# EAGLE design Mega_Shield-v13-VertPlace7 (EAGLE 7.5.0)
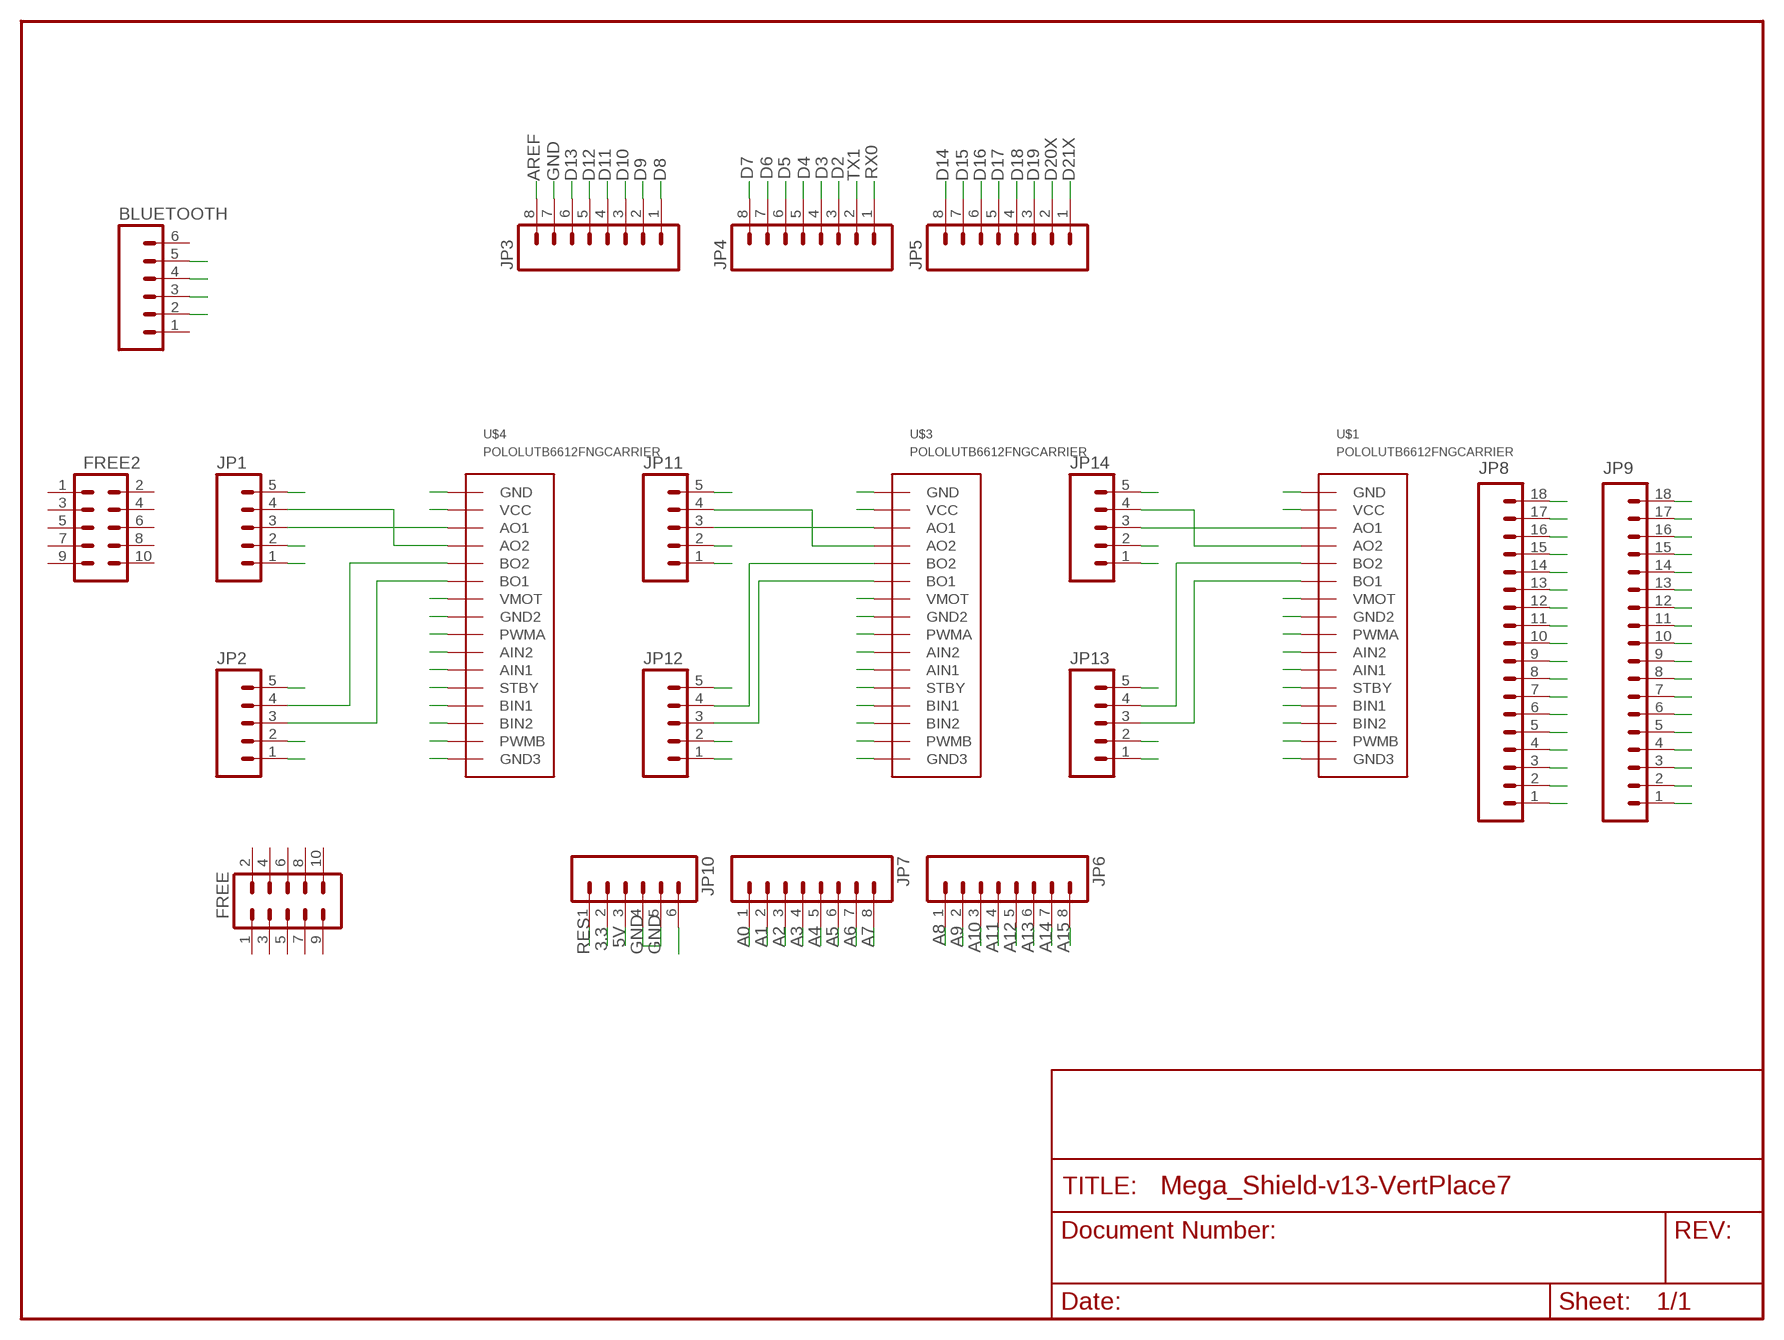
[diagram p0: schematic, sheet 1]

## Parts
BLUETOOTH  M06FEMALE_LOCK  [1X06_FEMALE_LOCK.010]
FREE  M05X2NO_SILK  [2X5_NOSILK]
FREE2  M05X2NO_SILK  [2X5_NOSILK]
JP1  M05LOCK  [1X05_LOCK]
JP2  M05LOCK  [1X05_LOCK]
JP3  M08LOCK  [1X08_LOCK]
JP4  M08LOCK  [1X08_LOCK]
JP5  M08LOCK  [1X08_LOCK]
JP6  M08LOCK  [1X08_LOCK]
JP7  M08LOCK  [1X08_LOCK]
JP8  M18_  [1X18]
JP9  M18_  [1X18]
JP10  M06LOCK  [1X06_LOCK]
JP11  M05LOCK  [1X05_LOCK]
JP12  M05LOCK  [1X05_LOCK]
JP13  M05LOCK  [1X05_LOCK]
JP14  M05LOCK  [1X05_LOCK]
U$1  POLOLUTB6612FNGCARRIER  [THROUGHHOLECARRIER]
U$3  POLOLUTB6612FNGCARRIER  [THROUGHHOLECARRIER]
U$4  POLOLUTB6612FNGCARRIER  [THROUGHHOLECARRIER]

## Nets
3.3: JP10.2
5V: BLUETOOTH.5 JP1.5 JP2.5 JP8.18 JP9.18 JP10.3 JP11.5 JP12.5 JP13.5 JP14.5 U$1.2(VCC) U$1.12(STBY) U$3.2(VCC) U$3.12(STBY) U$4.2(VCC) U$4.12(STBY)
A0: JP7.1 JP14.2
A1: JP7.2 JP13.2
A2: JP7.3 JP11.2
A3: JP7.4 JP12.2
A4: JP1.2 JP7.5
A5: JP2.2 JP7.6
A6: JP7.7
A7: JP7.8
A8: JP6.1
A9: JP6.2
A10: JP6.3
A11: JP6.4
A12: JP6.5
A13: JP6.6
A14: JP6.7
A15: JP6.8
AREF: JP3.8
D2: JP4.3 U$1.9(PWMA)
D3: JP4.4 U$1.15(PWMB)
D4: JP4.5 U$3.9(PWMA)
D5: JP4.6 U$3.15(PWMB)
D6: JP4.7 U$4.9(PWMA)
D7: JP4.8 U$4.15(PWMB)
D8: JP3.1
D9: JP3.2
D10: JP3.3
D11: JP3.4
D12: BLUETOOTH.2 JP3.5
D13: BLUETOOTH.3 JP3.6
D14: JP5.8
D15: JP5.7
D16: JP5.6
D17: JP5.5
D18: JP5.4
D19: JP5.3
D20X: JP5.2
D21X: JP5.1
D22: JP8.17
D23: JP9.17
D24: JP8.16
D25: JP9.16
D26: JP8.15
D27: JP9.15
D28: JP8.14
D29: JP9.14
D30: JP8.13
D31: JP9.13
D32: JP8.12
D33: JP9.12
D34: JP8.11
D35: JP9.11
D36: JP8.10
D37: JP9.10
D38: JP8.9
D40: JP8.8
D41: JP9.8
D42: JP8.7 U$4.14(BIN2)
D43: JP9.7 U$4.13(BIN1)
D44: JP8.6 U$4.10(AIN2)
D45: JP9.6 U$4.11(AIN1)
D46: JP8.5 U$3.14(BIN2)
D47: JP9.5 U$3.13(BIN1)
D48: JP8.4 U$3.10(AIN2)
D49: JP9.4 U$3.11(AIN1)
D50: JP8.3 U$1.14(BIN2)
D51: JP9.3 U$1.13(BIN1)
D52: JP8.2 U$1.10(AIN2)
D53: JP9.2 U$1.11(AIN1)
GND: BLUETOOTH.4 JP1.1 JP2.1 JP3.7 JP8.1 JP9.1 JP10.4 JP10.5 JP11.1 JP12.1 JP13.1 JP14.1 U$1.1(GND) U$1.8(GND2) U$1.16(GND3) U$3.1(GND) U$3.8(GND2) U$3.16(GND3) U$4.1(GND) U$4.8(GND2) U$4.16(GND3)
N$1: JP14.3 U$1.3(AO1)
N$3: JP9.9
N$5: JP14.4 U$1.4(AO2)
N$6: JP13.3 U$1.6(BO1)
N$7: JP13.4 U$1.5(BO2)
N$8: JP11.3 U$3.3(AO1)
N$11: JP12.3 U$3.6(BO1)
N$12: JP12.4 U$3.5(BO2)
N$13: JP11.4 U$3.4(AO2)
N$14: JP1.3 U$4.3(AO1)
N$15: JP1.4 U$4.4(AO2)
N$16: JP2.3 U$4.6(BO1)
N$17: JP2.4 U$4.5(BO2)
RES: JP10.1
RX0: JP4.1
TX1: JP4.2
VIN [PWR]: JP10.6 U$1.7(VMOT) U$3.7(VMOT) U$4.7(VMOT)
Unconnected: BLUETOOTH.1 BLUETOOTH.6 FREE2.1 FREE2.2 FREE2.3 FREE2.4 FREE2.5 FREE2.6 FREE2.7 FREE2.8 FREE2.9 FREE2.10 FREE.1 FREE.2 FREE.3 FREE.4 FREE.5 FREE.6 FREE.7 FREE.8 FREE.9 FREE.10

## Library data of the parts
BLUETOOTH = SparkFun-Connectors:M06: Header 6 Standard 6-pin 0.1" header. Use with straight break away headers (SKU : PRT-00116), right angle break away headers (PRT-00553), swiss pins (PRT-00743), machine pins (PRT-00117), and female headers (PRT-00115). Molex polarized connector foot print use with SKU : PRT-08094 with associated ...
FREE FREE2 = SparkFun-Connectors:M05X2: Header 5x2 Standard 10-pin dual row 0.1" header. Commonly used with AVR-ISP. Use with Spark Fun Electronics SKU: PRT-00778
JP1 JP2 JP11-JP14 = SparkFun-Connectors:M05: Header 5 Standard 5-pin 0.1" header. Use with straight break away headers (SKU : PRT-00116), right angle break away headers (PRT-00553), swiss pins (PRT-00743), machine pins (PRT-00117), and female headers (PRT-00115). Molex polarized connector foot print use with SKU : PRT-08230 with associated crimp pins and housings.
JP3-JP7 = SparkFun:M08: Header 8 Standard 8-pin 0.1" header. Use with straight break away headers (SKU : PRT-00116), right angle break away headers (PRT-00553), swiss pins (PRT-00743), machine pins (PRT-00117), and female headers (PRT-00115).
JP8 JP9 = SparkFun-Connectors:M18: 1x18 .1" header
JP10 = SparkFun:M06: Header 6 Standard 6-pin 0.1" header. Use with straight break away headers (SKU : PRT-00116), right angle break away headers (PRT-00553), swiss pins (PRT-00743), machine pins (PRT-00117), and female headers (PRT-00115). Molex polarized connector foot print use with SKU : PRT-08094 with associated ...
U$1 U$3 U$4 = pololutb6612nfgcarrier:POLOLUTB6612FNGCARRIER: My attempt to create an EAGLE Part corresonpding to the POLOLU through-hole carrier for their Dual-motor driver. https://www.pololu.com/product/713

## Net classes
1 PWR: width 1.778 mm

## Board
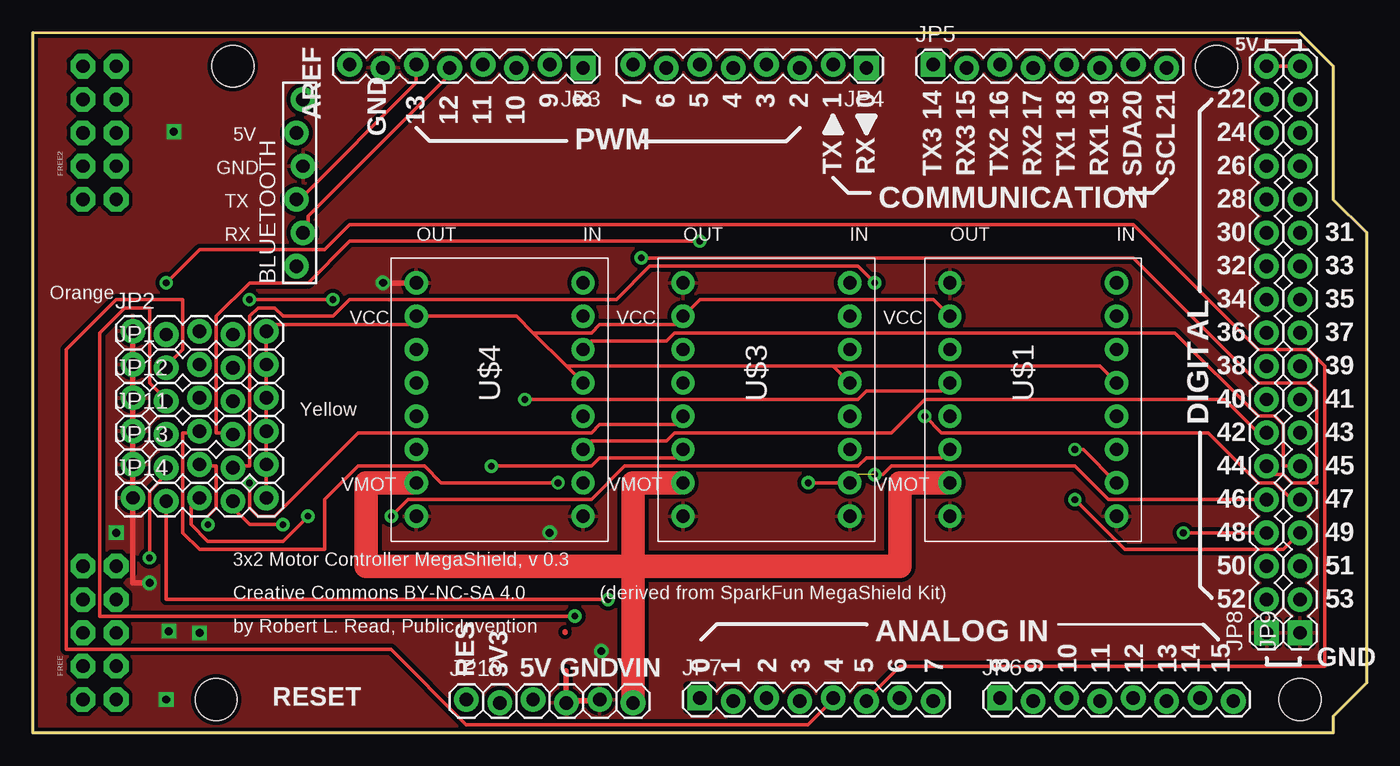
[diagram p1: board, top side]
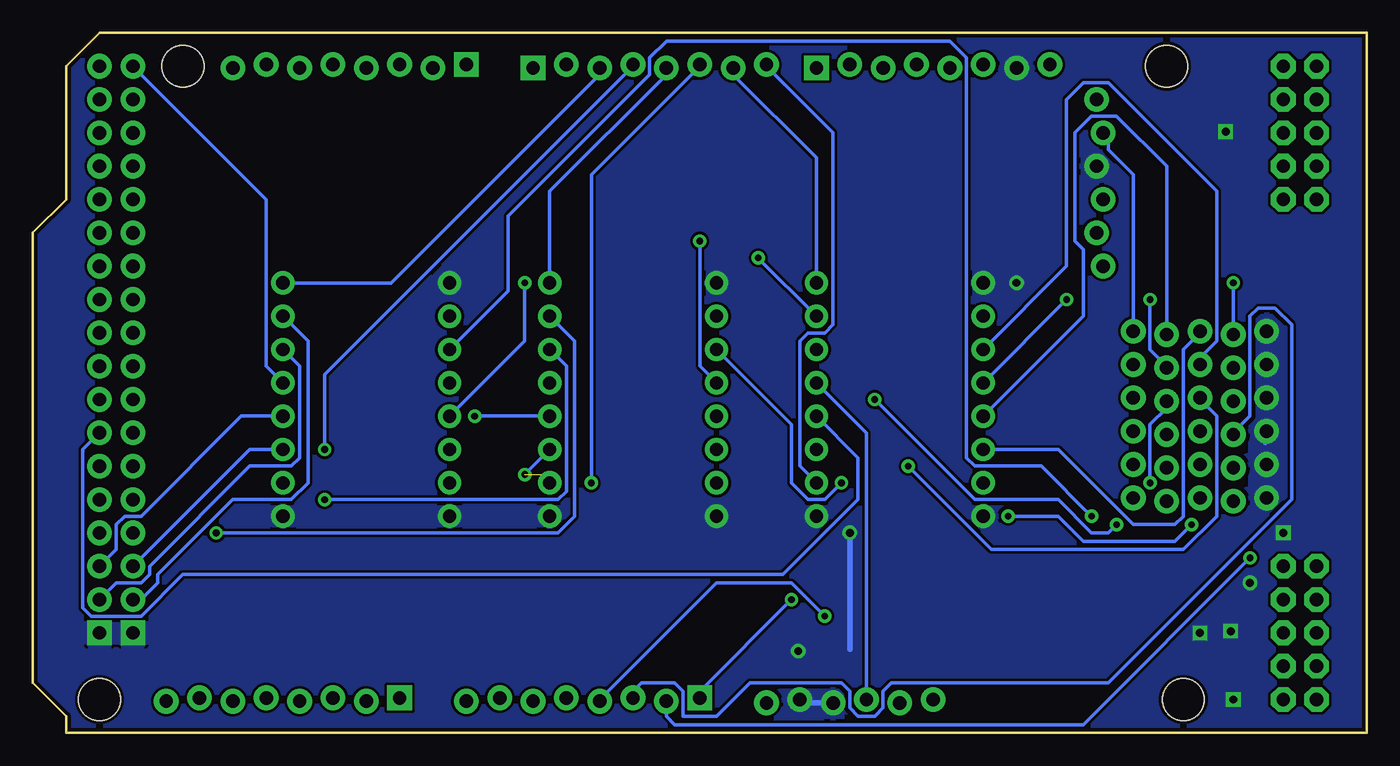
[diagram p2: board, bottom side, seen from below]

Size 101.6 x 53.34 mm. Coordinates in mm from the lower left corner, seen from the top.
Outline: 0,0 99.06,0 99.06,1.27 101.6,3.81 101.6,38.1 99.06,40.64 99.06,50.8 96.52,53.34 0,53.34 0,0
Copper layers (1*16): Top 0.035mm / dielectric 1.5mm / Bottom 0.035mm
Design rules "SparkFun *": minimum track width 10mil, minimum drill 20mil, track to track 8mil, track to pad 8mil, pad to pad 8mil, via to via 8mil, smd to smd 8mil, copper to edge 10mil, drill to drill 8mil, minimum pad ring 12mil, minimum via ring 10mil, stop-mask expansion 4mil, vias tented up to drill 25mil, thermal gap 10mil
Holes 3.2 mm at 15.24,50.8 13.97,2.54 90.17,50.8 96.52,2.54
tRestrict: area 7.4,12.2 to 7.5,13.4; area 7.4,12.2 to 7.6,13.4

### Footprints (pad centres in the part's own frame; a part is rotated, then mirrored left to right if it is on the bottom)
1X06_FEMALE_LOCK.010 = drill 1.016 pad 1.88: 1 0,0.254; 2 2.54,-0.254; 3 5.08,0.254; 4 7.62,-0.254; 5 10.16,0.254; 6 12.7,-0.254
2X5_NOSILK = drill 1.016 pad 1.88 octagon: 1 -1.27,5.08; 2 1.27,5.08; 3 -1.27,2.54; 4 1.27,2.54; 5 -1.27,0; 6 1.27,0; 7 -1.27,-2.54; 8 1.27,-2.54; 9 -1.27,-5.08; 10 1.27,-5.08
1X05_LOCK = drill 1.016 pad 1.88: 1 0,0.127; 2 2.54,-0.127; 3 5.08,0.127; 4 7.62,-0.127; 5 10.16,0.127
1X08_LOCK = drill 1.016 pad 1.88 square: 1 0,0.127 | drill 1.016 pad 1.88: 2 2.54,-0.127; 3 5.08,0.127; 4 7.62,-0.127; 5 10.16,0.127; 6 12.7,-0.127; 7 15.24,0.127; 8 17.78,-0.127
1X18 = drill 1.016 pad 1.88 square: 1 0,0 | drill 1.016 pad 1.88: 2 2.54,0; 3 5.08,0; 4 7.62,0; 5 10.16,0; 6 12.7,0; 7 15.24,0; 8 17.78,0; 9 20.32,0; 10 22.86,0; 11 25.4,0; 12 27.94,0; 13 30.48,0; 14 33.02,0; 15 35.56,0; 16 38.1,0; 17 40.64,0; 18 43.18,0
1X06_LOCK = drill 1.016 pad 1.88: 1 0,0; 2 2.54,-0.254; 3 5.08,0; 4 7.62,-0.254; 5 10.16,0; 6 12.7,-0.254
THROUGHHOLECARRIER = drill 1 pad 1.778: 1 -6.35,8.89; 2 -6.35,6.35; 3 -6.35,3.81; 4 -6.35,1.27; 5 -6.35,-1.27; 6 -6.35,-3.81; 7 -6.35,-6.35; 8 -6.35,-8.89; 9 6.35,8.89; 10 6.35,6.35; 11 6.35,3.81; 12 6.35,1.27; 13 6.35,-1.27; 14 6.35,-3.81; 15 6.35,-6.35; 16 6.35,-8.89

### Placement (x,y rotation side)
BLUETOOTH  20.32,35.56 90 top
FREE  5.08,7.62 0 top
FREE2  5.08,45.72 0 top
JP1  7.62,27.94 0 top
JP2  7.62,30.48 0 top
JP3  41.91,50.8 180 top
JP4  63.5,50.8 180 top
JP5  68.58,50.8 0 top
JP6  73.66,2.54 0 top
JP7  50.8,2.54 0 top
JP8  93.98,7.62 90 top
JP9  96.52,7.62 90 top
JP10  33.02,2.54 0 top
JP11  7.62,22.86 0 top
JP12  7.62,25.4 0 top
JP13  7.62,20.32 0 top
JP14  7.62,17.78 0 top
U$1  76.2,25.4 0 top
U$3  55.88,25.4 0 top
U$4  35.56,25.4 0 top

### Tracks (layer width: path | path; a pad name or v marks a point on that pad's centre or on a via)
5V
  Top 0.254: JP14.5 JP13.5 JP11.5 JP12.5 JP1.5 JP2.5 17.78,31.11 28.57,31.11 U$4.2 36.83,31.75 38.1,30.48 | JP9.18 JP8.18 | 38.1,30.48 40.64,27.94 | 40.64,27.94 U$4.12 | 38.1,30.48 42.55,30.48 43.18,31.11 48.9,31.11 U$3.2 50.8,33.02 68.58,33.02 U$1.2 | 60.96,27.94 U$3.12 | 40.64,27.94 60.96,27.94 | U$1.12 81.28,27.94 60.96,27.94
  Bottom 0.254: JP2.5 17.78,42.55 19.68,44.45 19.68,45.72 BLUETOOTH.5 | JP10.3 38.1,22.86 U$4.12 | JP8.18 83.82,40.64 83.82,27.94 U$1.12
A0  (via drill 0.51)
  Top 0.254: JP14.2 10.16,10.16 v43.81,10.16
  Bottom 0.254: v43.81,10.16 50.8,3.17 JP7.1
A1  (via drill 0.51)
  Top 0.254: v8.89,13.34 8.89,18.41 10.16,19.68 JP13.2
  Bottom 0.254: v8.89,13.34 21.59,0.64 52.7,0.64 53.34,1.27 JP7.2
A2
  Bottom 0.254: JP11.2 10.16,22.86 8.89,24.13 8.89,31.75 8.26,32.38 6.99,32.38 5.71,31.11 5.71,17.78 19.68,3.81 36.2,3.81 36.83,3.17 36.83,1.91 37.47,1.27 38.73,1.27 39.37,1.91 39.37,3.17 40.01,3.81 46.99,3.81 49.53,1.27 52.07,1.27 52.07,3.17 52.7,3.81 55.24,3.81 55.88,3.17 JP7.3
A3  (via drill 0.51)
  Top 0.254: v41.27,8.89 5.08,8.89 5.08,30.48 6.99,32.38 8.89,32.38 8.89,26.67 10.16,25.4 JP12.2
  Bottom 0.254: v41.27,8.89 43.81,11.43 49.53,11.43 58.42,2.54 JP7.4
A4
  Top 0.254: JP1.2 10.16,27.94 11.43,29.21 11.43,33.02 6.35,33.02 2.54,29.21 2.54,6.35 27.3,6.35 33.02,0.64 59.05,0.64 60.96,2.54 JP7.5
A5  (via drill 0.51)
  Top 0.254: v10.16,34.29 12.7,36.83 22.23,36.83 24.13,38.73 83.82,38.73 93.34,29.21 97.16,29.21 98.42,27.94 98.42,5.08 66.04,5.08 63.5,2.54 JP7.6
  Bottom 0.254: v10.16,34.29 JP2.2
D2
  Bottom 0.254: U$1.9 74.3,34.29 58.42,50.16 JP4.3
D3  (via drill 0.51)
  Top 0.254: U$1.15 80.01,21.59 v79.38,21.59
  Bottom 0.254: v79.38,21.59 79.38,27.3 55.88,50.8 JP4.4
D4
  Bottom 0.254: U$3.9 62.23,41.27 53.34,50.16 JP4.5
D5  (via drill 0.51)
  Top 0.254: v59.05,19.05 U$3.15
  Bottom 0.254: v59.05,19.05 59.05,42.55 50.8,50.8 JP4.6
D6
  Bottom 0.254: U$4.9 41.91,43.81 48.26,50.16 JP4.7
D7
  Bottom 0.254: U$4.15 43.18,20.32 43.18,29.84 42.55,30.48 41.27,30.48 40.64,31.11 40.64,45.72 45.72,50.8 JP4.8
D12
  Top 0.254: BLUETOOTH.2 20.95,38.1 20.95,39.37 31.75,50.16 JP3.5
D13
  Top 0.254: JP3.6 29.21,49.53 20.32,40.64 BLUETOOTH.3
D42
  Top 0.254: U$4.14 42.55,22.23 48.26,22.23 48.9,22.86 65.41,22.86 67.94,25.4 90.81,25.4 93.34,22.86 JP8.7
D43
  Bottom 0.254: U$4.13 38.73,20.95 38.73,17.78 44.45,12.06 90.17,12.06 93.34,8.89 97.16,8.89 97.79,9.53 97.79,21.59 JP9.7
D44  (via drill 0.51)
  Top 0.254: v46.35,36.2 83.82,36.2 93.34,26.67 97.16,26.67 97.79,26.04 97.79,19.05 95.89,19.05 95.25,19.68 94.61,19.68 JP8.6
  Bottom 0.254: v46.35,36.2 U$4.10
D45
  Top 0.254: U$4.11 42.55,29.84 48.26,29.84 48.9,30.48 87,30.48 93.34,24.13 94.61,24.13 95.25,23.5 95.25,20.32 JP9.6
D46  (via drill 0.51)  (1 unrouted)
  Top 0.254: v64.14,19.68 64.77,19.68 65.41,20.32 79.38,20.32 81.92,17.78 JP8.5
  Bottom 0.254: v64.14,19.68 U$3.14
D47  (via drill 0.51)
  Top 0.254: v67.94,24.13 69.22,22.86 89.53,22.86 93.34,19.05 94.61,19.05 95.89,17.78 JP9.5
  Bottom 0.254: v67.94,24.13 U$3.13
D48  (via drill 0.51)
  Top 0.254: JP8.4 v87.63,15.24
  Bottom 0.254: U$3.10 60.33,29.84 60.33,16.51 61.59,15.24 v87.63,15.24
D49  (via drill 0.51)
  Top 0.254: v79.38,17.78 83.19,13.97 95.25,13.97 JP9.4
  Bottom 0.254: U$3.11 60.96,27.94 60.96,18.41 61.59,17.78 v79.38,17.78
D50
  Bottom 0.254: U$1.14 85.09,21.59 JP8.3
D51
  Bottom 0.254: U$1.13 85.72,24.13 93.34,16.51 94.61,16.51 95.25,15.88 95.25,13.97 JP9.3
D52
  Bottom 0.254: U$1.10 80.64,29.84 80.64,19.05 81.92,17.78 86.36,17.78 92.08,12.06 92.08,11.43 93.34,10.16 JP8.2
D53
  Bottom 0.254: U$1.11 81.28,27.94 81.28,20.95 81.92,20.32 85.09,20.32 92.71,12.7 92.71,12.06 93.34,11.43 95.25,11.43 JP9.2
GND  (via drill 0.6)
  Top 0.406: JP2.1 JP11.1 7.62,11.43 v8.89,11.43 | U$4.1 v26.67,34.29
  Bottom 0.254: 7.67,22.06 7.77,22.06 JP11.1
  Bottom 0.406: 39.37,6.35 v39.37,15.24 | JP10.4 43.18,2.29 JP10.5
  other vias: 43.3,6.24 10.74,45.81 10.36,7.75 6.35,15.24 12.7,7.62 10.16,2.54
  pour Bottom (isolate 0.305): 0,0 99.06,0 99.06,1.27 101.6,3.81 101.6,38.1 99.06,40.64 99.06,50.8 96.52,53.34 0,53.34
  pour Top (isolate 0.305): 0,0 99.06,0 99.06,1.27 101.6,3.81 101.6,38.1 99.06,40.64 99.06,50.8 96.52,53.34 0,53.34
  pour Bottom: -2.54,55.88 104.14,55.88 104.14,53.34 104.14,0 -2.54,0
N$1  (via drill 0.51)
  Top 0.254: v20.95,16.51 19.05,14.61 13.34,14.61 12.06,15.88 12.06,17.78 12.7,17.78 JP14.3
  Bottom 0.254: U$1.3 65.41,33.66 65.41,39.37 54.61,50.16 54.61,51.44 53.34,52.7 31.75,52.7 30.48,51.44 30.48,20.95 29.84,20.32 24.77,20.32 v20.95,16.51
N$5  (via drill 0.51)
  Top 0.254: U$1.4 69.22,26.04 63.5,26.04 62.87,25.4 v37.47,25.4 | v19.05,15.88 16.51,15.88 15.24,17.14 JP14.4
  Bottom 0.254: v37.47,25.4 29.84,17.78 23.5,17.78 20.95,15.24 19.68,15.24 v19.05,15.88
N$6  (via drill 0.51)
  Top 0.254: U$1.6 69.22,20.95 63.5,20.95 62.87,20.32 45.09,20.32 42.55,17.78 28.57,17.78 v27.3,16.51 | v13.34,15.88 13.34,16.51 13.97,17.14 13.97,20.32 12.7,20.32 JP13.3
  Bottom 0.254: v27.3,16.51 23.5,16.51 21.59,14.61 14.61,14.61 v13.34,15.88
N$7  (via drill 0.51)
  Top 0.254: v64.14,34.29 62.87,35.56 46.99,35.56 44.45,33.02 24.13,33.02 22.86,31.75 19.05,31.75 18.41,32.38 17.14,32.38 16.51,31.75 16.51,20.32 15.24,20.32 JP13.4
  Bottom 0.254: U$1.5 64.14,29.84 v64.14,34.29
N$8  (via drill 0.51)
  Top 0.254: v40.01,19.05 31.11,19.05 29.84,20.32 24.77,20.32 22.23,17.78 22.23,13.97 12.7,13.97 11.43,15.24 11.43,22.86 12.7,22.86 JP11.3
  Bottom 0.254: U$3.3 43.81,23.5 43.81,19.05 42.55,17.78 41.27,17.78 v40.01,19.05
N$9
  Top 0.406: 40.66,2.51 40.6,2.51 40.6,4.74
N$11  (via drill 0.51)
  Top 0.254: U$3.6 48.9,20.95 43.18,20.95 42.55,20.32 v34.92,20.32
  Bottom 0.254: v34.92,20.32 28.57,13.97 13.97,13.97 11.43,16.51 11.43,24.13 12.7,25.4 JP12.3
N$12  (via drill 0.51)
  Top 0.254: U$3.5 48.9,23.5 43.18,23.5 42.55,22.86 24.77,22.86 18.41,16.51 17.14,16.51 16.51,17.14 v16.51,19.05
  Bottom 0.254: v16.51,19.05 16.51,23.5 15.24,24.77 JP12.4
N$13  (via drill 0.51)
  Top 0.254: v50.8,37.47 24.13,37.47 20.95,34.29 16.51,34.29 13.97,31.75 13.97,22.86 15.24,22.86 JP11.4
  Bottom 0.254: U$3.4 50.8,27.94 v50.8,37.47
N$14
  Bottom 0.254: U$4.3 22.86,35.56 22.86,48.26 21.59,49.53 19.68,49.53 11.43,41.27 11.43,29.84 12.7,28.57 JP1.3
N$15  (via drill 0.51)
  Top 0.254: v16.51,33.02 v22.86,33.02
  Bottom 0.254: v22.86,33.02 U$4.4 | v16.51,33.02 16.51,29.21 15.24,27.94 JP1.4
N$16
  Bottom 0.254: U$4.6 23.5,21.59 17.78,15.88 14.61,15.88 13.97,16.51 13.97,29.21 12.7,30.48 JP2.3
N$17
  Bottom 0.254: U$4.5 21.59,31.75 21.59,36.83 22.23,37.47 22.23,45.72 20.95,46.99 19.05,46.99 15.24,43.18 JP2.4
N$18
  Bottom 0.406: 43.17,2.43 43.17,2.41
N$19
  Top 0.406: 40.7,2.44 43.1,2.44 43.1,2.41
N$20
  Top 0.406: 40.54,7.7 40.54,7.65
VIN
  Top 1.778: JP10.6 45.72,12.7 | 45.72,12.7 45.72,19.05 U$3.7 | U$1.7 66.04,19.05 66.04,12.7 45.72,12.7 | 45.72,12.7 25.4,12.7 25.4,19.05 U$4.7

### Text on the board
tPlace: 5V | 9 | 8 | 7 | 6 | 5 | 4 | 3 | 2 | 1 | 0 | 22 | AREF | 14 | 15 | 16 | 17 | 18 | 19 | 20 | 21 | 13 | 12 | 11 | 10 | GND | 24 | PWM | TX | RX | 26 | TX3 | RX3 | TX2 | RX2 | TX1 | RX1 | SDA | SCL | COMMUNICATION | 28 | 30 | 31 | 32 | 33 | 34 | 35 | 36 | 37 | 38 | 39 | 40 | 41 | DIGITAL | 42 | 43 | 44 | 45 | 46 | 47 | 48 | 49 | 50 | 51 | 52 | 53 | ANALOG IN | 0 | 1 | 2 | 3 | 4 | 5 | 6 | 7 | 8 | 9 | 10 | 11 | 12 | 13 | 14 | 15 | GND | RES | 3V3 | 5V | GND | VIN | RESET
tNames: 5V | GND | TX | RX | OUT | IN | OUT | IN | OUT | IN | Orange | VCC | VCC | VCC | Yellow | VMOT | VMOT | VMOT | 3x2 Motor Controller MegaShield, v 0.3 | Creative Commons BY-NC-SA 4.0 | (derived from SparkFun MegaShield Kit) | by Robert L. Read, Public Invention